# EAGLE design 13_RESTOREFLAGS (EAGLE 7.5.0)
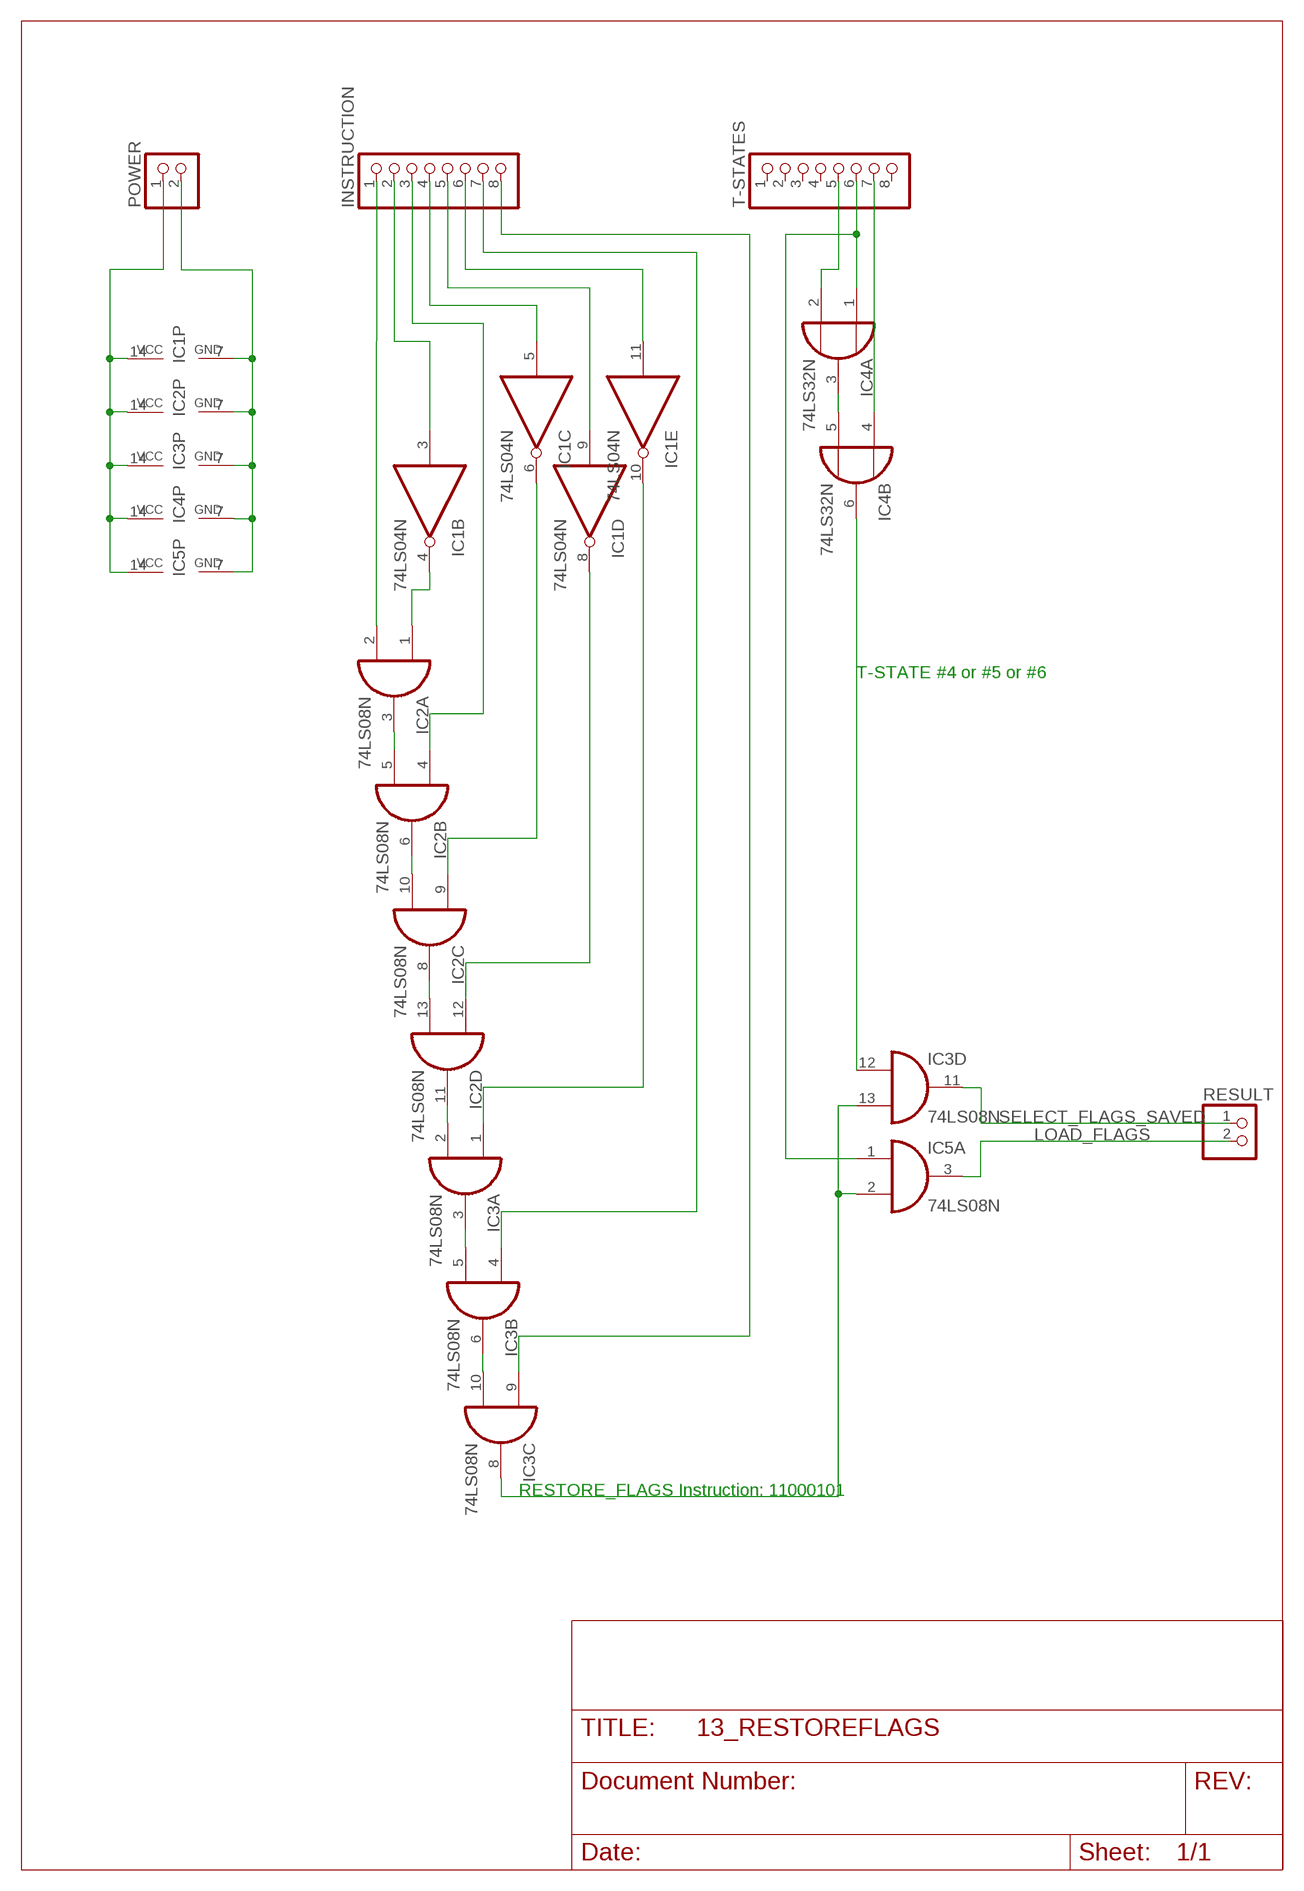
[diagram p0: schematic, sheet 1]

## Parts
IC1  74LS04N  [DIL14]
IC2  74LS08N  [DIL14]
IC3  74LS08N  [DIL14]
IC4  74LS32N  [DIL14]
IC5  74LS08N  [DIL14]
INSTRUCTION  PINHD-1X8  [1X08]
POWER  PINHD-1X2  [1X02]
RESULT  PINHD-1X2  [1X02]
T-STATES  PINHD-1X8  [1X08]

## Nets
GND: IC1.7(P:GND) IC2.7(P:GND) IC3.7(P:GND) IC4.7(P:GND) IC5.7(P:GND) POWER.2
LOAD_FLAGS: IC5.3(A:O) RESULT.2
N$1: IC2.2(A:I1) INSTRUCTION.1
N$2: IC1.3(B:I) INSTRUCTION.2
N$3: IC2.4(B:I0) INSTRUCTION.3
N$4: IC4.3(A:O) IC4.5(B:I1)
N$5: IC1.4(B:O) IC2.1(A:I0)
N$6: IC1.6(C:O) IC2.9(C:I0)
N$7: IC1.8(D:O) IC2.12(D:I0)
N$8: IC1.10(E:O) IC3.1(A:I0)
N$9: IC1.5(C:I) INSTRUCTION.4
N$10: IC1.9(D:I) INSTRUCTION.5
N$11: IC1.11(E:I) INSTRUCTION.6
N$12: IC3.4(B:I0) INSTRUCTION.7
N$13: IC3.9(C:I0) INSTRUCTION.8
N$14: IC4.4(B:I0) T-STATES.7
N$15: IC2.3(A:O) IC2.5(B:I1)
N$16: IC2.6(B:O) IC2.10(C:I1)
N$17: IC2.8(C:O) IC2.13(D:I1)
N$18: IC2.11(D:O) IC3.2(A:I1)
N$19: IC3.3(A:O) IC3.5(B:I1)
N$20: IC3.6(B:O) IC3.10(C:I1)
N$21: IC3.8(C:O) IC3.13(D:I1) IC5.2(A:I1)
N$22: IC4.1(A:I0) IC5.1(A:I0) T-STATES.6
N$24: IC3.12(D:I0) IC4.6(B:O)
N$25: IC4.2(A:I1) T-STATES.5
SELECT_FLAGS_SAVED: IC3.11(D:O) RESULT.1
VCC: IC1.14(P:VCC) IC2.14(P:VCC) IC3.14(P:VCC) IC4.14(P:VCC) IC5.14(P:VCC) POWER.1
Unconnected: IC1.1(A:I) IC1.2(A:O) IC1.12(F:O) IC1.13(F:I) IC4.8(C:O) IC4.9(C:I0) IC4.10(C:I1) IC4.11(D:O) IC4.12(D:I0) IC4.13(D:I1) IC5.4(B:I0) IC5.5(B:I1) IC5.6(B:O) IC5.8(C:O) IC5.9(C:I0) IC5.10(C:I1) IC5.11(D:O) IC5.12(D:I0) IC5.13(D:I1) T-STATES.1 T-STATES.2 T-STATES.3 T-STATES.4 T-STATES.8

## Notes on the sheet
- T-STATE #4 or #5 or #6
- RESTORE_FLAGS Instruction: 11000101

## Library data of the parts
IC1 = 74xx-eu:74*04: Hex INVERTER
IC2 IC3 IC5 = 74xx-eu:74*08: Quad 2-input AND gate
IC4 = 74xx-eu:74*32: Quad 2-input OR gate
INSTRUCTION T-STATES = pinhead:PINHD-1X8: PIN HEADER
POWER RESULT = pinhead:PINHD-1X2: PIN HEADER

## Board
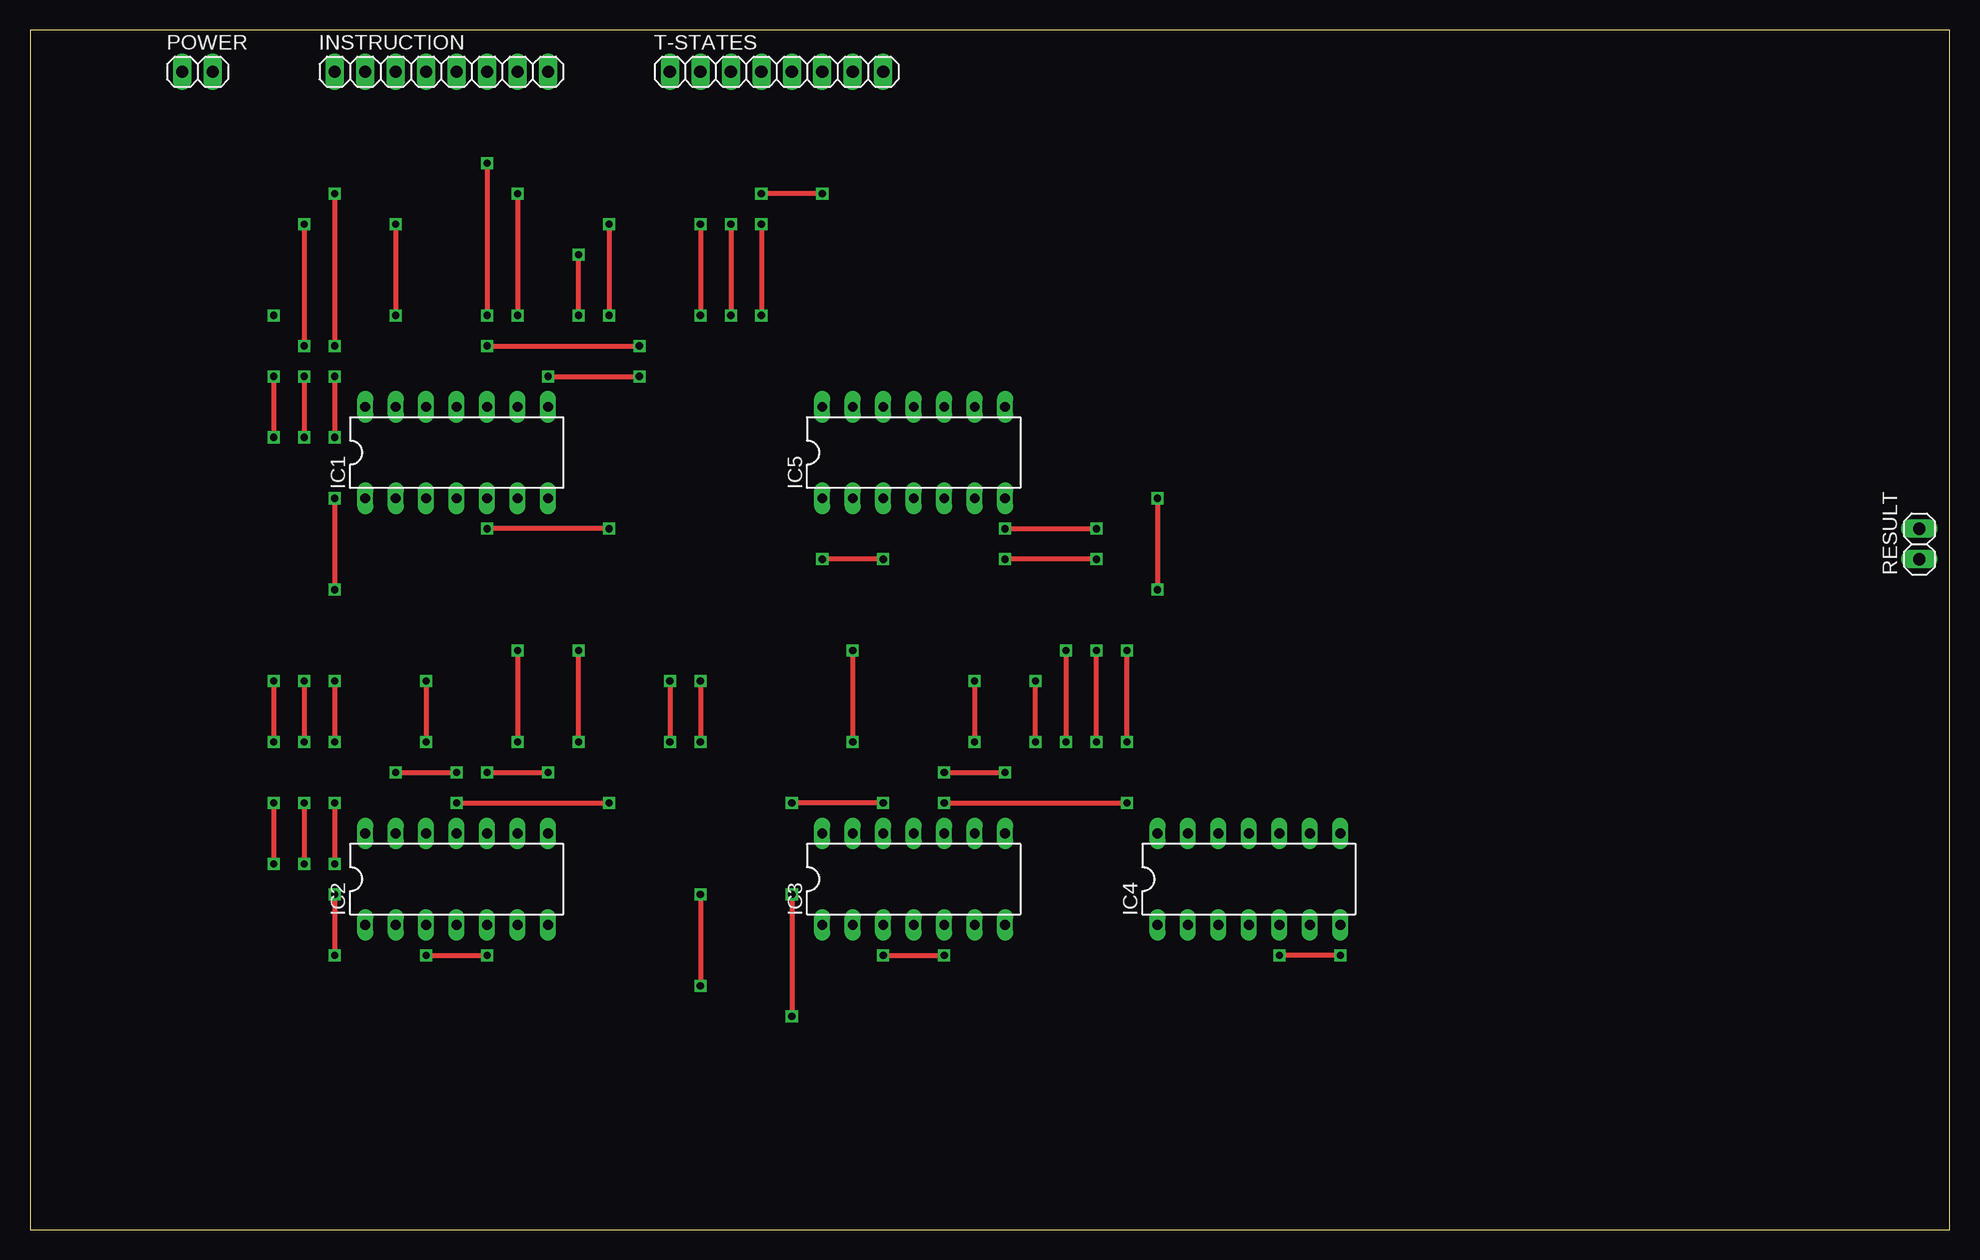
[diagram p1: board, top side]
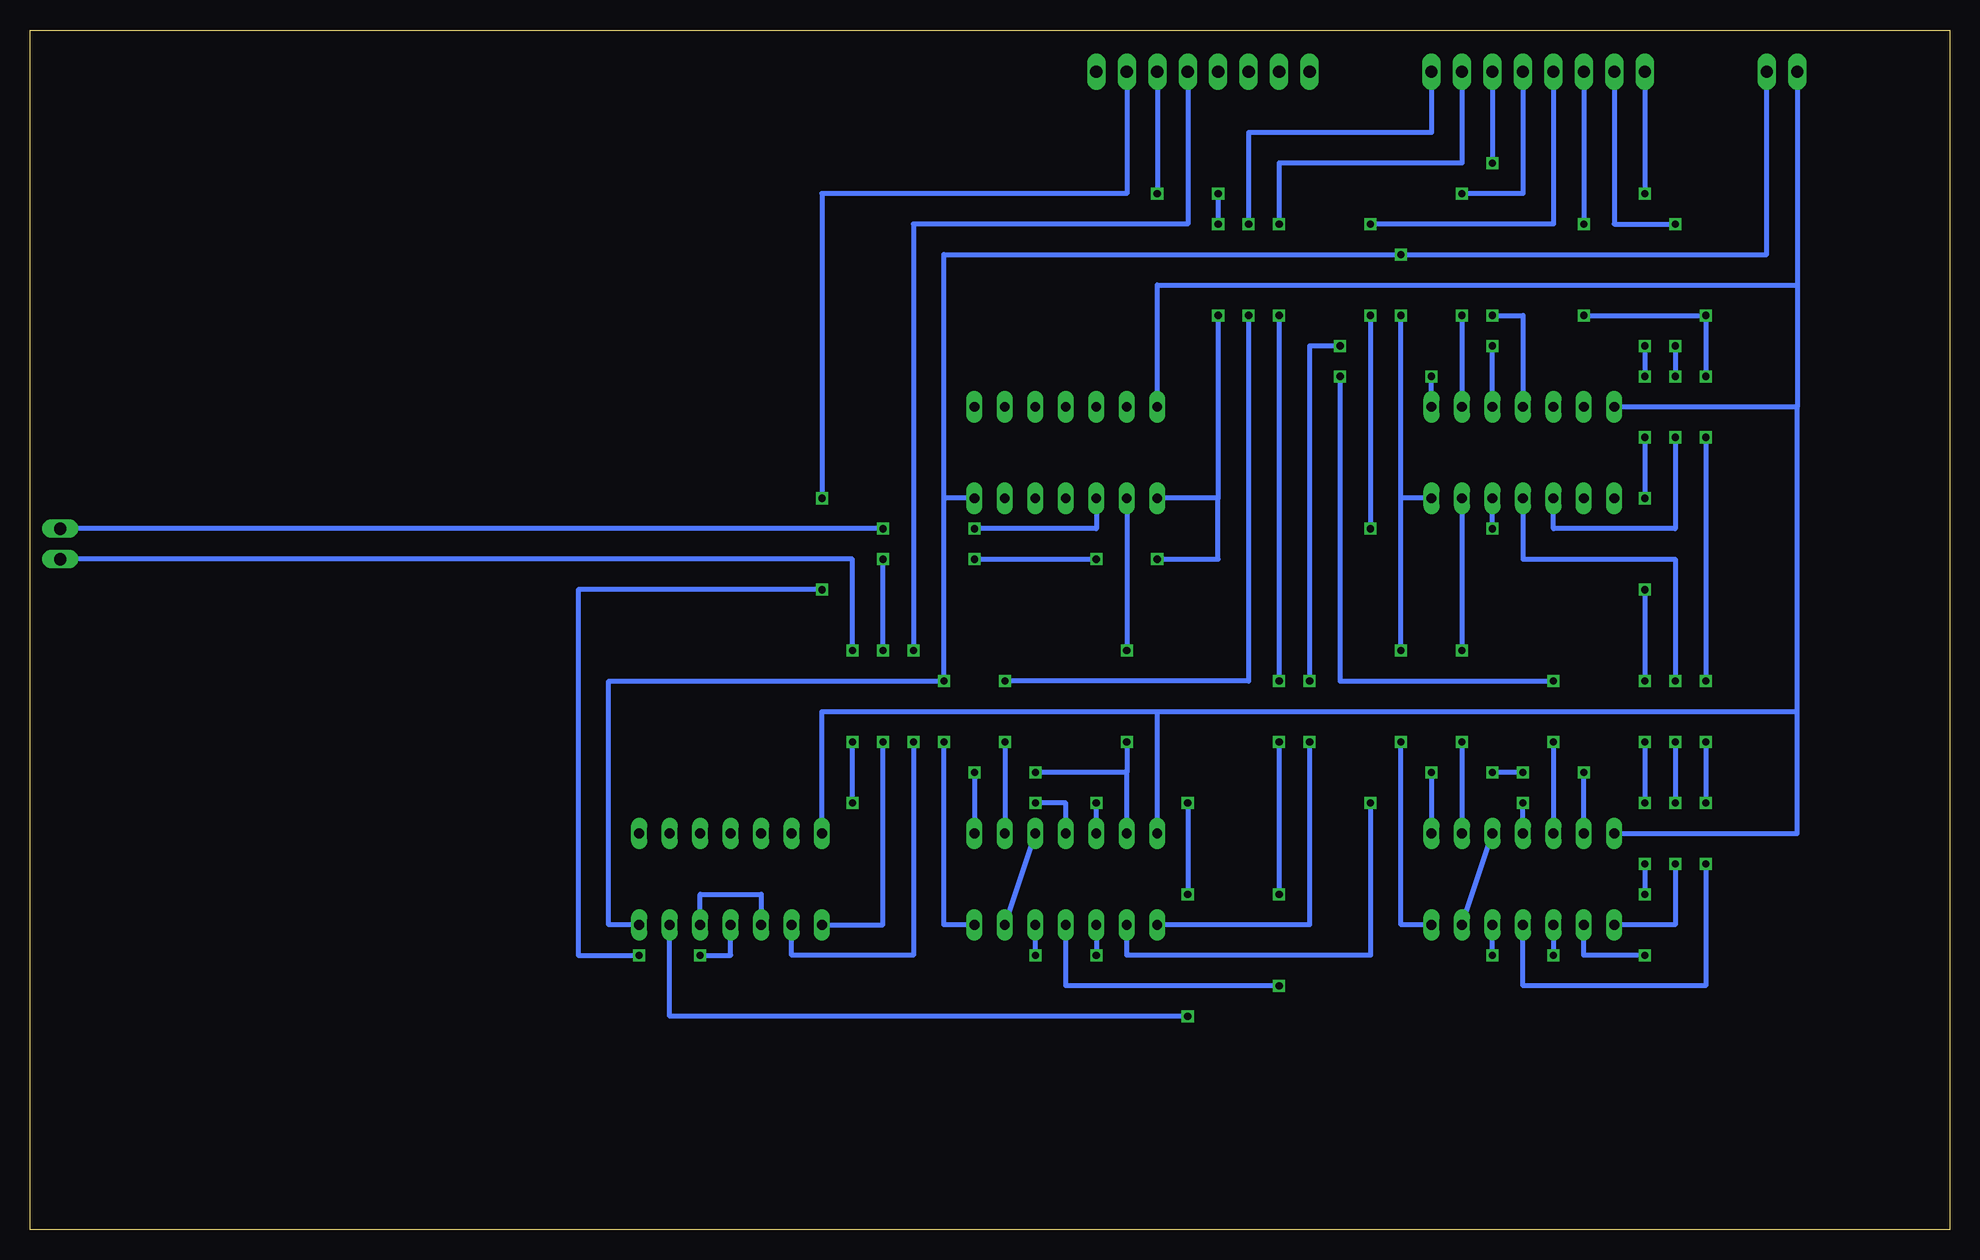
[diagram p2: board, bottom side, seen from below]

Size 160 x 100 mm. Coordinates in mm from the lower left corner, seen from the top.
Outline: 0,0 160,0 160,100 0,100 0,0
Copper layers (1*16): Top 0.035mm / dielectric 1.5mm / Bottom 0.035mm
Design rules "default": minimum track width 10mil, minimum drill 24mil, track to track 8mil, track to pad 8mil, pad to pad 8mil, via to via 8mil, smd to smd 8mil, copper to edge 40mil, drill to drill 8mil, minimum pad ring 10mil, minimum via ring 8mil, stop-mask expansion 4mil, vias tented up to drill 0mil, thermal gap 10mil

### Footprints (pad centres in the part's own frame; a part is rotated, then mirrored left to right if it is on the bottom)
DIL14 = drill 0.813 long: 1 -7.62,-3.81; 2 -5.08,-3.81; 3 -2.54,-3.81; 4 0,-3.81; 5 2.54,-3.81; 6 5.08,-3.81; 7 7.62,-3.81; 8 7.62,3.81; 9 5.08,3.81; 10 2.54,3.81; 11 0,3.81; 12 -2.54,3.81; 13 -5.08,3.81; 14 -7.62,3.81
1X08 = drill 1.016 long: 1 -8.89,0; 2 -6.35,0; 3 -3.81,0; 4 -1.27,0; 5 1.27,0; 6 3.81,0; 7 6.35,0; 8 8.89,0
1X02 = drill 1.016 long: 1 -1.27,0; 2 1.27,0

### Placement (x,y rotation side)
IC1  35.56,64.77 0 top
IC2  35.56,29.21 0 top
IC3  73.66,29.21 0 top
IC4  101.6,29.21 0 top
IC5  73.66,64.77 0 top
INSTRUCTION  34.29,96.52 0 top
POWER  13.97,96.52 0 top
RESULT  157.48,57.15 90 top
T-STATES  62.23,96.52 0 top

### Tracks (layer width: path | path; a pad name or v marks a point on that pad's centre or on a via)
GND  (via drill 0.6)
  Top 0.406: v45.72,76.2 v45.72,81.28 | v83.82,40.64 v83.82,45.72 | v45.72,40.64 v45.72,48.26
  Bottom 0.406: IC1.7 45.72,60.96 | 45.72,60.96 v45.72,76.2 | POWER.2 15.24,81.28 v45.72,81.28 83.82,81.28 83.82,60.96 | IC5.7 83.82,60.96 | IC3.7 83.82,25.4 v83.82,40.64 | 83.82,60.96 v83.82,45.72 111.76,45.72 111.76,25.4 IC4.7 | IC2.7 45.72,25.4 v45.72,40.64 | v45.72,48.26 45.72,60.96
LOAD_FLAGS  (via drill 0.6)
  Top 0.406: v81.28,58.42 v88.9,58.42
  Bottom 0.406: IC5.3 71.12,58.42 v81.28,58.42 | v88.9,58.42 RESULT.2
N$1  (via drill 0.6)
  Top 0.406: v25.4,86.36 v25.4,73.66 | v25.4,71.12 v25.4,66.04 | v25.4,60.96 v25.4,53.34 | v25.4,45.72 v25.4,40.64 | v25.4,35.56 v25.4,30.48 | v25.4,27.94 v25.4,22.86
  Bottom 0.406: INSTRUCTION.1 v25.4,86.36 | v25.4,73.66 v25.4,71.12 | v25.4,66.04 v25.4,60.96 | v25.4,53.34 v25.4,45.72 | v25.4,40.64 v25.4,35.56 | v25.4,30.48 v25.4,27.94 | v25.4,22.86 30.48,22.86 IC2.2
N$2  (via drill 0.6)
  Top 0.406: v22.86,83.82 v22.86,73.66 | v22.86,71.12 v22.86,66.04
  Bottom 0.406: INSTRUCTION.2 27.94,83.82 v22.86,83.82 | v22.86,73.66 v22.86,71.12 | v22.86,66.04 22.86,58.42 33.02,58.42 IC1.3
N$3  (via drill 0.6)
  Top 0.406: v30.48,83.82 v30.48,76.2 | v20.32,71.12 v20.32,66.04 | v20.32,45.72 v20.32,40.64 | v20.32,35.56 v20.32,30.48
  Bottom 0.406: INSTRUCTION.3 v30.48,83.82 | v30.48,76.2 v20.32,76.2 v20.32,71.12 | v20.32,66.04 v20.32,45.72 | v20.32,40.64 v20.32,35.56 | v20.32,30.48 20.32,20.32 35.56,20.32 IC2.4
N$4
  Bottom 0.406: IC4.5 104.14,27.94 99.06,27.94 IC4.3
N$5  (via drill 0.6)
  Top 0.406: v22.86,45.72 v22.86,40.64 | v22.86,35.56 v22.86,30.48
  Bottom 0.406: IC1.4 35.56,55.88 22.86,55.88 v22.86,45.72 | v22.86,40.64 v22.86,35.56 | v22.86,30.48 22.86,25.4 IC2.1
N$6  (via drill 0.6)
  Top 0.406: v40.64,48.26 v40.64,40.64
  Bottom 0.406: IC1.6 v40.64,48.26 | v40.64,40.64 IC2.9
N$7  (via drill 0.6)
  Top 0.406: v43.18,71.12 v50.8,71.12 | v33.02,45.72 v33.02,40.64
  Bottom 0.406: IC1.8 v43.18,71.12 | v50.8,71.12 50.8,45.72 v33.02,45.72 | v33.02,40.64 IC2.12
N$8  (via drill 0.6)
  Top 0.406: v38.1,73.66 v50.8,73.66 | v53.34,45.72 v53.34,40.64
  Bottom 0.406: IC1.10 v38.1,73.66 | v50.8,73.66 53.34,73.66 v53.34,45.72 | v53.34,40.64 53.34,25.4 IC3.1
N$9  (via drill 0.6)
  Top 0.406: v48.26,83.82 v48.26,76.2 | v48.26,58.42 v38.1,58.42
  Bottom 0.406: INSTRUCTION.4 33.02,83.82 v48.26,83.82 | v48.26,76.2 v48.26,58.42 | v38.1,58.42 IC1.5
N$10  (via drill 0.6)
  Top 0.406: v40.64,86.36 v40.64,76.2
  Bottom 0.406: INSTRUCTION.5 35.56,86.36 v40.64,86.36 | v40.64,76.2 IC1.9
N$11  (via drill 0.6)
  Top 0.406: v38.1,88.9 v38.1,76.2
  Bottom 0.406: INSTRUCTION.6 v38.1,88.9 | v38.1,76.2 35.56,76.2 IC1.11
N$12  (via drill 0.6)
  Top 0.406: v55.88,83.82 v55.88,76.2 | v55.88,45.72 v55.88,40.64 | v55.88,27.94 v55.88,20.32
  Bottom 0.406: INSTRUCTION.7 40.64,88.9 55.88,88.9 v55.88,83.82 | v55.88,76.2 v55.88,45.72 | v55.88,40.64 v55.88,27.94 | v55.88,20.32 73.66,20.32 IC3.4
N$13  (via drill 0.6)
  Top 0.406: v58.42,83.82 v58.42,76.2 | v78.74,45.72 v78.74,40.64
  Bottom 0.406: INSTRUCTION.8 43.18,91.44 58.42,91.44 v58.42,83.82 | v58.42,76.2 58.42,45.72 v78.74,45.72 | v78.74,40.64 IC3.9
N$14  (via drill 0.6)
  Top 0.406: v93.98,60.96 v93.98,53.34 | v109.22,22.86 v104.14,22.86
  Bottom 0.406: T-STATES.7 68.58,86.36 93.98,86.36 v93.98,60.96 | v93.98,53.34 114.3,53.34 114.3,22.86 v109.22,22.86 | v104.14,22.86 101.6,22.86 IC4.4
N$15  (via drill 0.6)
  Top 0.406: v33.02,22.86 v38.1,22.86
  Bottom 0.406: IC2.3 v33.02,22.86 | v38.1,22.86 IC2.5
N$16
  Bottom 0.406: IC2.6 IC2.10
N$17  (via drill 0.6)
  Top 0.406: v30.48,38.1 v35.56,38.1 | v38.1,38.1 v43.18,38.1
  Bottom 0.406: IC2.13 v30.48,38.1 | v35.56,38.1 v38.1,38.1 | v43.18,38.1 IC2.8
N$18  (via drill 0.6)
  Top 0.406: v35.56,35.56 v48.26,35.56
  Bottom 0.406: IC2.11 v35.56,35.56 | v48.26,35.56 48.26,22.86 68.58,22.86 IC3.2
N$19  (via drill 0.6)
  Top 0.406: v71.12,22.86 v76.2,22.86
  Bottom 0.406: IC3.3 v71.12,22.86 | v76.2,22.86 IC3.5
N$20
  Bottom 0.406: IC3.6 IC3.10
N$21  (via drill 0.6)
  Top 0.406: v68.58,48.26 v68.58,40.64 | v76.2,38.1 v81.28,38.1
  Bottom 0.406: IC5.2 v68.58,48.26 | v68.58,40.64 68.58,38.1 | IC3.13 68.58,38.1 | 68.58,38.1 v76.2,38.1 | v81.28,38.1 IC3.8
N$22  (via drill 0.6)
  Top 0.406: v66.04,86.36 v60.96,86.36 | v60.96,83.82 v60.96,76.2 | v88.9,40.64 v88.9,48.26 | v88.9,55.88 v81.28,55.88 | v71.12,55.88 v66.04,55.88
  Bottom 0.406: T-STATES.6 v66.04,86.36 | v60.96,86.36 v60.96,83.82 | v60.96,76.2 60.96,60.96 | 60.96,60.96 IC5.1 | IC4.1 88.9,25.4 v88.9,40.64 | v88.9,48.26 v88.9,55.88 | v81.28,55.88 v71.12,55.88 | v66.04,55.88 60.96,55.88 60.96,60.96
N$24  (via drill 0.6)
  Top 0.406: v71.12,35.56 v63.5,35.56 | v63.5,27.94 v63.5,17.78
  Bottom 0.406: IC3.12 v71.12,35.56 | v63.5,35.56 v63.5,27.94 | v63.5,17.78 106.68,17.78 IC4.6
N$25  (via drill 0.6)
  Top 0.406: v86.36,48.26 v86.36,40.64
  Bottom 0.406: T-STATES.5 63.5,83.82 86.36,83.82 v86.36,48.26 | v86.36,40.64 86.36,22.86 96.52,22.86 IC4.2
SELECT_FLAGS_SAVED  (via drill 0.6)
  Top 0.406: v76.2,35.56 v91.44,35.56 | v91.44,40.64 v91.44,48.26
  Bottom 0.406: IC3.11 73.66,35.56 v76.2,35.56 | v91.44,35.56 v91.44,40.64 | v91.44,48.26 91.44,55.88 RESULT.1
VCC
  Bottom 0.406: POWER.1 12.7,78.74 | 12.7,78.74 12.7,68.58 | 12.7,68.58 IC1.14 | IC5.14 66.04,78.74 12.7,78.74 | IC2.14 12.7,33.02 12.7,43.18 | 12.7,43.18 12.7,68.58 | IC3.14 66.04,43.18 | 66.04,43.18 12.7,43.18 | IC4.14 93.98,43.18 66.04,43.18